# Altium schematic sheet CapTouchKeyboard_v2.0.SchDoc
size 355 x 355 mm
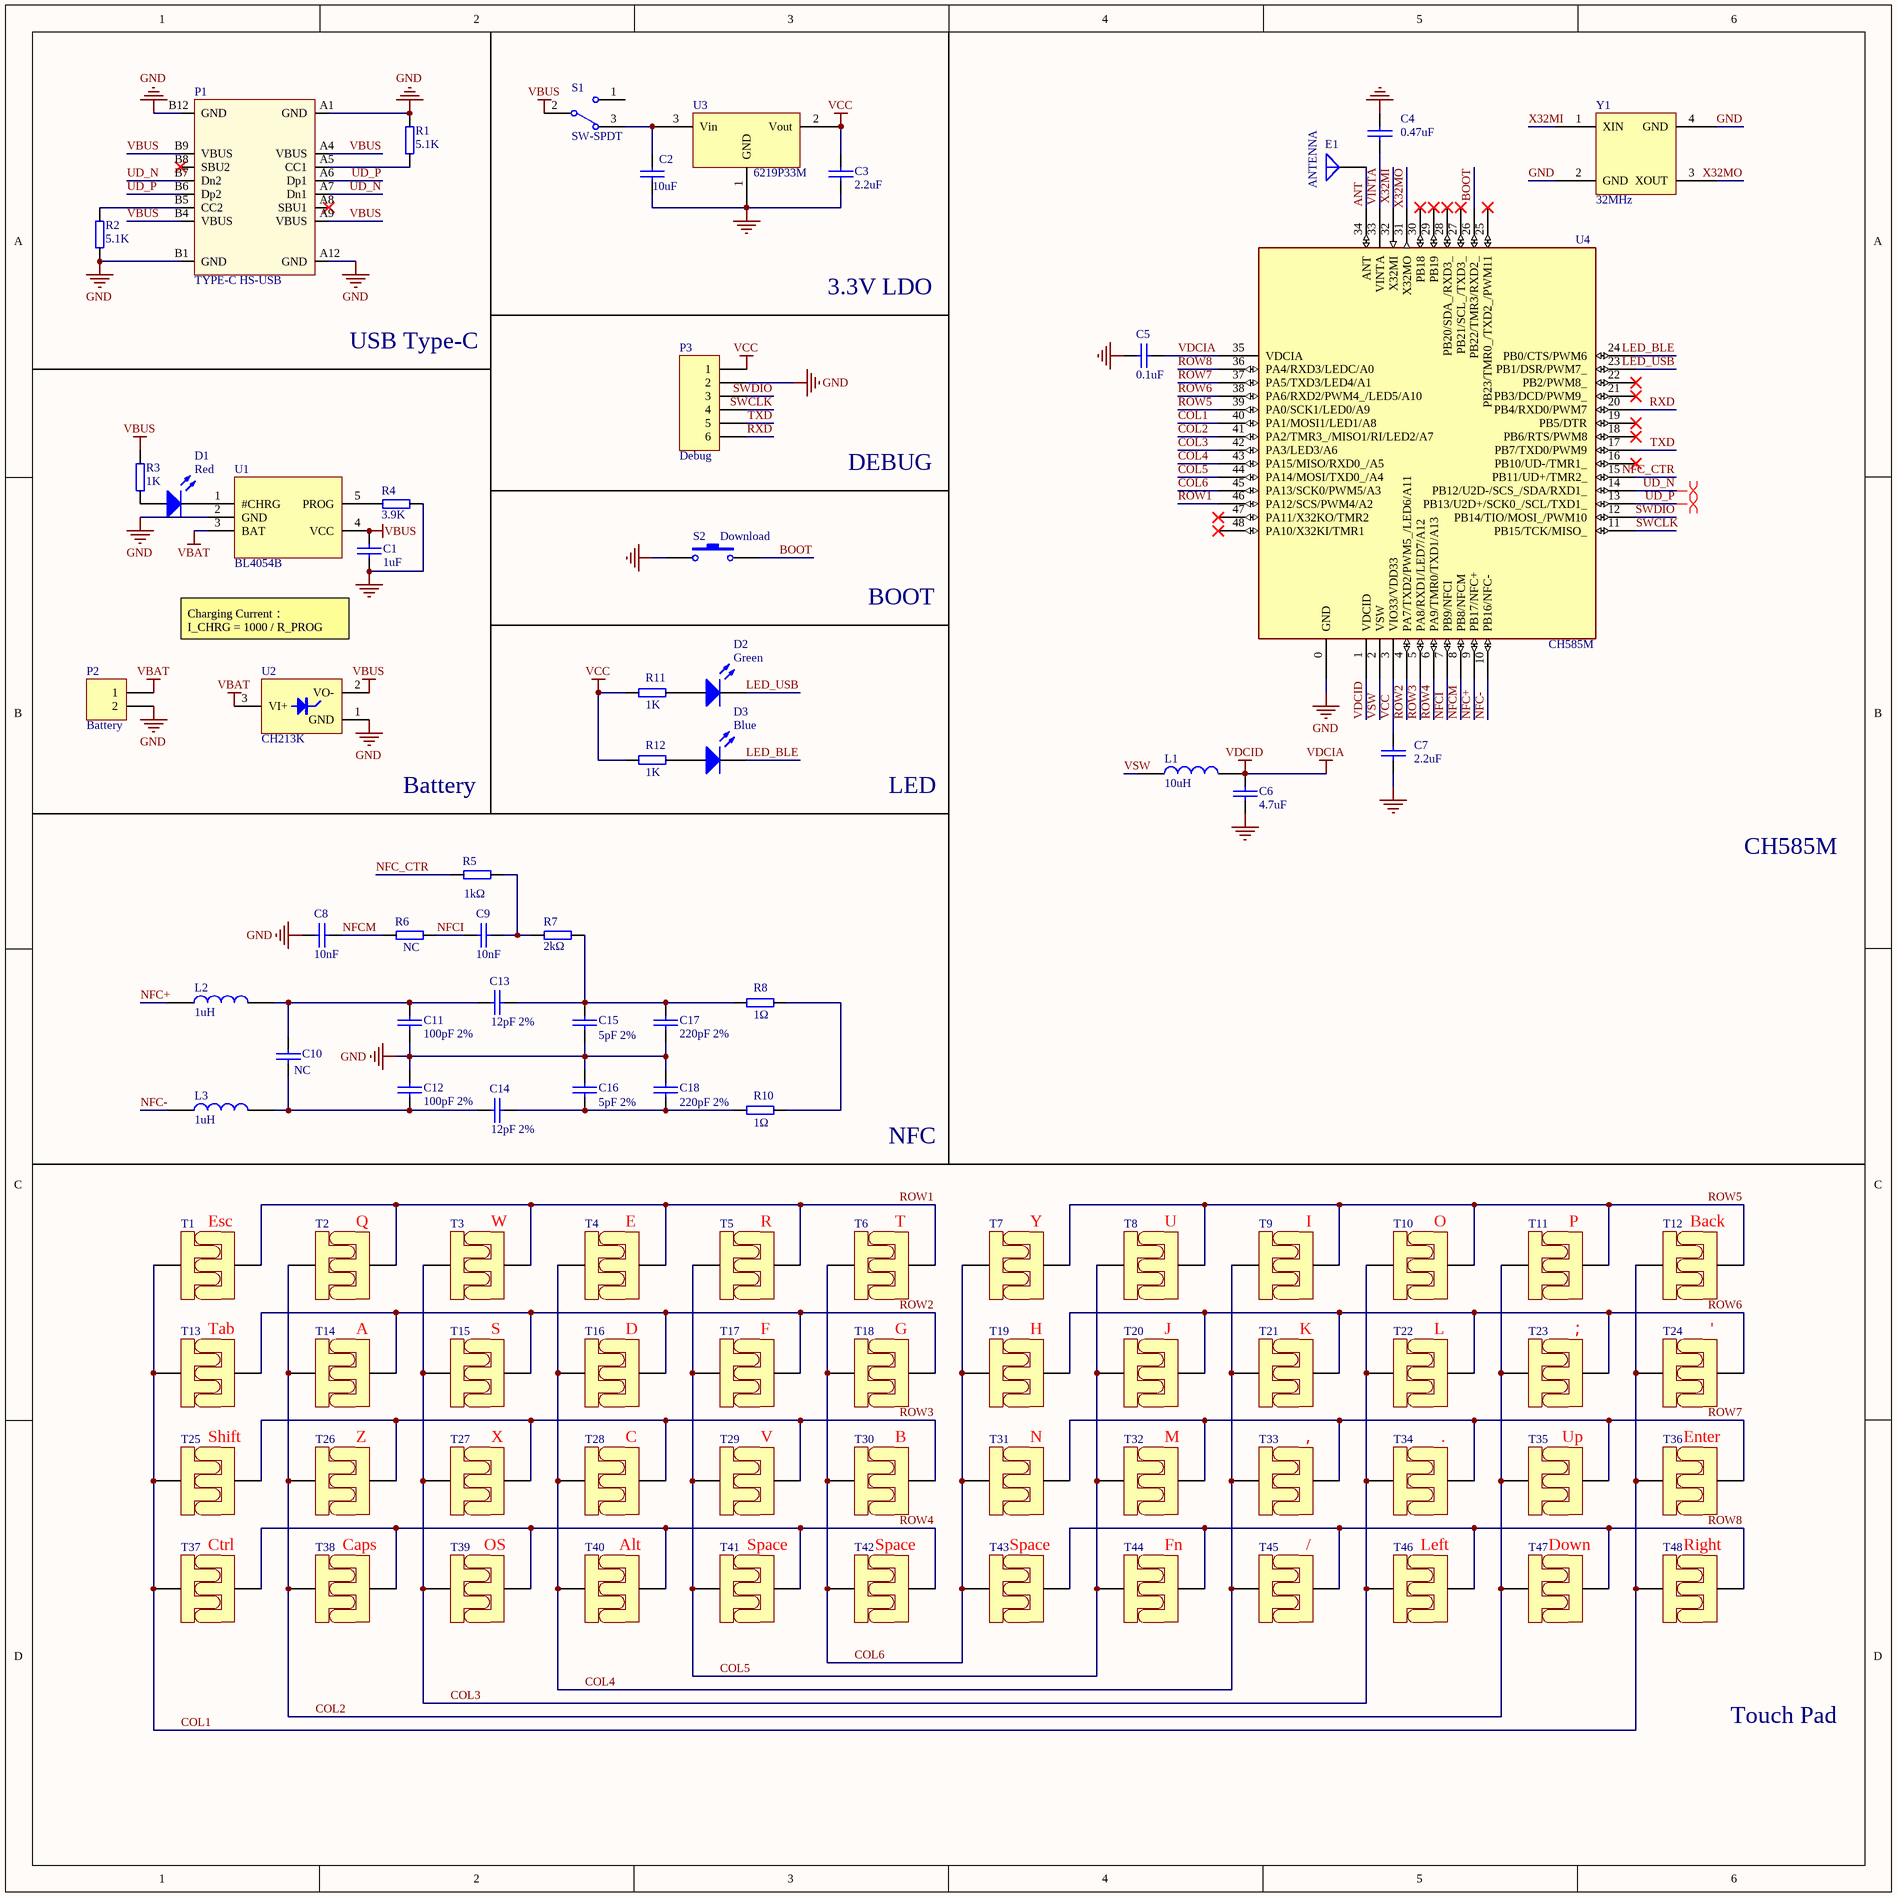
[diagram p0: CapTouchKeyboard_v2.0.SchDoc]

## Parts
C1  1uF  [0402_C]
C2  10uF  [0603_C]
C3  2.2uF  [0402_C]
C4  0.47uF  [0402_C]
C5  0.1uF  [0402_C]
C6  4.7uF  [0402_C]
C7  2.2uF  [0402_C]
C8  10nF  [0402_C]
C9  10nF  [0402_C]
C10  NC  [0402_C]
C11  100pF 2%  [0402_C]
C12  100pF 2%  [0402_C]
C13  12pF 2%  [0402_C]
C14  12pF 2%  [0402_C]
C15  5pF 2%  [0402_C]
C16  5pF 2%  [0402_C]
C17  220pF 2%  [0402_C]
C18  220pF 2%  [0402_C]
D1  Red  [0603+]
D2  Green  [0603+]
D3  Blue  [0603+]
E1  ANTENNA  [ANT-F-1-2.4G-0.8mmFR4-WCH]
L1  10uH  [SMD_2x2mm]
L2  1uH  [0603]
L3  1uH  [0603]
P1  TYPE-C HS-USB  [USB_TYPE_C_DS_2]
P2  Battery  [XH-2P-P1.25mm-WT]
P3  Debug  [HDR1X6H]
R1  5.1K  [0402]
R2  5.1K  [0402]
R3  1K  [0402]
R4  3.9K  [0402]
R5  1kΩ  [0402]
R6  NC  [0402]
R7  2kΩ  [0402]
R8  1Ω  [0402]
R10  1Ω  [0402]
R11  1K  [0402]
R12  1K  [0402]
S1  SW-SPDT  [SW1 - SMD (2)]
S2  Download  [SMD_4.1x2.3x3.5mm-KEY (2)]
T1  TouchPad  [TOUCH_PAD]  (value not drawn)
T2  TouchPad  [TOUCH_PAD]  (value not drawn)
T3  TouchPad  [TOUCH_PAD]  (value not drawn)
T4  TouchPad  [TOUCH_PAD]  (value not drawn)
T5  TouchPad  [TOUCH_PAD]  (value not drawn)
T6  TouchPad  [TOUCH_PAD]  (value not drawn)
T7  TouchPad  [TOUCH_PAD]  (value not drawn)
T8  TouchPad  [TOUCH_PAD]  (value not drawn)
T9  TouchPad  [TOUCH_PAD]  (value not drawn)
T10  TouchPad  [TOUCH_PAD]  (value not drawn)
T11  TouchPad  [TOUCH_PAD]  (value not drawn)
T12  TouchPad  [TOUCH_PAD]  (value not drawn)
T13  TouchPad  [TOUCH_PAD]  (value not drawn)
T14  TouchPad  [TOUCH_PAD]  (value not drawn)
T15  TouchPad  [TOUCH_PAD]  (value not drawn)
T16  TouchPad  [TOUCH_PAD]  (value not drawn)
T17  TouchPad  [TOUCH_PAD]  (value not drawn)
T18  TouchPad  [TOUCH_PAD]  (value not drawn)
T19  TouchPad  [TOUCH_PAD]  (value not drawn)
T20  TouchPad  [TOUCH_PAD]  (value not drawn)
T21  TouchPad  [TOUCH_PAD]  (value not drawn)
T22  TouchPad  [TOUCH_PAD]  (value not drawn)
T23  TouchPad  [TOUCH_PAD]  (value not drawn)
T24  TouchPad  [TOUCH_PAD]  (value not drawn)
T25  TouchPad  [TOUCH_PAD]  (value not drawn)
T26  TouchPad  [TOUCH_PAD]  (value not drawn)
T27  TouchPad  [TOUCH_PAD]  (value not drawn)
T28  TouchPad  [TOUCH_PAD]  (value not drawn)
T29  TouchPad  [TOUCH_PAD]  (value not drawn)
T30  TouchPad  [TOUCH_PAD]  (value not drawn)
T31  TouchPad  [TOUCH_PAD]  (value not drawn)
T32  TouchPad  [TOUCH_PAD]  (value not drawn)
T33  TouchPad  [TOUCH_PAD]  (value not drawn)
T34  TouchPad  [TOUCH_PAD]  (value not drawn)
T35  TouchPad  [TOUCH_PAD]  (value not drawn)
T36  TouchPad  [TOUCH_PAD]  (value not drawn)
T37  TouchPad  [TOUCH_PAD]  (value not drawn)
T38  TouchPad  [TOUCH_PAD]  (value not drawn)
T39  TouchPad  [TOUCH_PAD]  (value not drawn)
T40  TouchPad  [TOUCH_PAD]  (value not drawn)
T41  TouchPad  [TOUCH_PAD]  (value not drawn)
T42  TouchPad  [TOUCH_PAD]  (value not drawn)
T43  TouchPad  [TOUCH_PAD]  (value not drawn)
T44  TouchPad  [TOUCH_PAD]  (value not drawn)
T45  TouchPad  [TOUCH_PAD]  (value not drawn)
T46  TouchPad  [TOUCH_PAD]  (value not drawn)
T47  TouchPad  [TOUCH_PAD]  (value not drawn)
T48  TouchPad  [TOUCH_PAD]  (value not drawn)
U1  BL4054B  [SOT-23-5]
U2  CH213K  [SOT-23-3]
U3  6219P33M  [SOT-23]
U4  CH585M  [QFN48_5X5]
Y1  32MHz  [2016]

## Nets
GND: C1.2 C2.2 C3.2 C4.2 C5.2 C6.1 C7.1 C8.2 C11.1 C12.2 C15.1 C16.2 C17.1 C18.2 P1.A1(GND) P1.A12(GND) P1.B1(GND) P1.B12(GND) P2.2 P3.2 R1.2 R2.1 R4.1 S2.1 U1.2(GND) U2.1(GND) U3.1(GND) U4.0(GND) Y1.2(GND) Y1.4(GND)
VBAT: P2.1 U1.3(BAT) U2.3(VI+)
VBUS: C1.1 P1.A4(VBUS) P1.A9(VBUS) P1.B4(VBUS) P1.B9(VBUS) R3.2 S1.2 U1.4(VCC) U2.2(VO-)
VCC: C3.1 C7.2 P3.1 R11.1 R12.1 U3.2(Vout) U4.3(VIO33/VDD33)
VDCIA: C5.1 C6.2 L1.2 U4.1(VDCID) U4.35(VDCIA)  [also labelled VDCID]
ANT: E1.1(A) U4.34(ANT)
BOOT: S2.2 U4.26(PB22/TMR3/RXD2_)
COL1: T1.1 T12.1 T13.1 T24.1 T25.1 T36.1 T37.1 T48.1 U4.40(PA1/MOSI1/LED1/A8)
COL2: T2.1 T11.1 T14.1 T23.1 T26.1 T35.1 T38.1 T47.1 U4.41(PA2/TMR3_/MISO1/RI/LED2/A7)
COL3: T3.1 T10.1 T15.1 T22.1 T27.1 T34.1 T39.1 T46.1 U4.42(PA3/LED3/A6)
COL4: T4.1 T9.1 T16.1 T21.1 T28.1 T33.1 T40.1 T45.1 U4.43(PA15/MISO/RXD0_/A5)
COL5: T5.1 T8.1 T17.1 T20.1 T29.1 T32.1 T41.1 T44.1 U4.44(PA14/MOSI/TXD0_/A4)
COL6: T6.1 T7.1 T18.1 T19.1 T30.1 T31.1 T42.1 T43.1 U4.45(PA13/SCK0/PWM5/A3)
LED_BLE: D3.2(K) U4.24(PB0/CTS/PWM6)
LED_USB: D2.2(K) U4.23(PB1/DSR/PWM7_)
NFC+: L2.1 U4.9(PB17/NFC+)
NFC-: L3.1 U4.10(PB16/NFC-)
NFC_CTR: R5.2 U4.15(PB11/UD+/TMR2_)
NFCI: C9.1 R6.1 U4.7(PB9/NFCI)
NFCM: C8.1 R6.2 U4.8(PB8/NFCM)
ROW1: T1.2 T2.2 T3.2 T4.2 T5.2 T6.2 U4.46(PA12/SCS/PWM4/A2)
ROW2: T13.2 T14.2 T15.2 T16.2 T17.2 T18.2 U4.4(PA7/TXD2/PWM5_/LED6/A11)
ROW3: T25.2 T26.2 T27.2 T28.2 T29.2 T30.2 U4.5(PA8/RXD1/LED7/A12)
ROW4: T37.2 T38.2 T39.2 T40.2 T41.2 T42.2 U4.6(PA9/TMR0/TXD1/A13)
ROW5: T7.2 T8.2 T9.2 T10.2 T11.2 T12.2 U4.39(PA0/SCK1/LED0/A9)
ROW6: T19.2 T20.2 T21.2 T22.2 T23.2 T24.2 U4.38(PA6/RXD2/PWM4_/LED5/A10)
ROW7: T31.2 T32.2 T33.2 T34.2 T35.2 T36.2 U4.37(PA5/TXD3/LED4/A1)
ROW8: T43.2 T44.2 T45.2 T46.2 T47.2 T48.2 U4.36(PA4/RXD3/LEDC/A0)
RXD: P3.6 U4.20(PB4/RXD0/PWM7)
SWCLK: P3.4 U4.11(PB15/TCK/MISO_)
SWDIO: P3.3 U4.12(PB14/TIO/MOSI_/PWM10)
TXD: P3.5 U4.17(PB7/TXD0/PWM9)
UD_N: P1.A7(Dn1) P1.B7(Dn2) U4.14(PB12/U2D-/SCS_/SDA/RXD1_)
UD_P: P1.A6(Dp1) P1.B6(Dp2) U4.13(PB13/U2D+/SCK0_/SCL/TXD1_)
VINTA: C4.1 U4.33(VINTA)
VSW: L1.1 U4.2(VSW)
X32MI: U4.32(X32MI) Y1.1(XIN)
X32MO: U4.31(X32MO) Y1.3(XOUT)
NetC2_1: C2.1 S1.3 U3.3(Vin)
NetC9_2: C9.2 R5.1 R7.2
NetC10_1: C10.1 C12.1 C14.1 L3.2
NetC10_2: C10.2 C11.2 C13.1 L2.2
NetC13_2: C13.2 C15.2 C17.2 R7.1 R8.1
NetC14_2: C14.2 C16.1 C18.1 R10.1
NetD1_1: D1.1(A) R3.1
NetD1_2: D1.2(K) U1.1(#CHRG)
NetD2_1: D2.1(A) R11.2
NetD3_1: D3.1(A) R12.2
NetP1_A5: P1.A5(CC1) R1.1
NetP1_B5: P1.B5(CC2) R2.2
NetR4_2: R4.2 U1.5(PROG)
NetR8_2: R8.2 R10.2

Not connected (* = marked no-connect by the designer): P1 A8(SBU1)* B8(SBU2)*; S1 1; U4 16(PB10/UD-/TMR1_)* 18(PB6/RTS/PWM8)* 19(PB5/DTR)* 21(PB3/DCD/PWM9_)* 22(PB2/PWM8_)* 25(PB23/TMR0_/TXD2_/PWM11)* 27(PB21/SCL_/TXD3_)* 28(PB20/SDA_/RXD3_)* 29(PB19)* 30(PB18)* 47(PA11/X32KO/TMR2)* 48(PA10/X32KI/TMR1)*

## Layout directives
differential pair: UD_N, UD_P

## Notes on the sheet
- 3.3V LDO
- USB Type-C
- DEBUG
- Charging Current：
  I_CHRG = 1000 / R_PROG
- BOOT
- Battery
- LED
- CH585M
- NFC
- (near T1) Esc
- (near T2) Q
- (near T3) W
- (near T4) E
- (near T5) R
- (near T6) T
- (near T7) Y
- (near T8) U
- (near T9) I
- (near T10) O
- (near T11) P
- (near T12) Back
- (near T13) Tab
- (near T14) A
- (near T15) S
- (near T16) D
- (near T17) F
- (near T18) G
- (near T19) H
- (near T20) J
- (near T21) K
- (near T22) L
- (near T23) ；
- (near T24) '
- (near T25) Shift
- (near T26) Z
- (near T27) X
- (near T28) C
- (near T29) V
- (near T30) B
- (near T31) N
- (near T32) M
- (near T33) ，
- (near T34) .
- (near T35) Up
- (near T36) Enter
- (near T37) Ctrl
- (near T38) Caps
- (near T39) OS
- (near T40) Alt
- (near T41) Space
- (near T42) Space
- (near T43) Space
- (near T44) Fn
- (near T45) /
- (near T46) Left
- (near T47) Down
- (near T48) Right
- Touch Pad

## Library data of the parts
C1-C18 = CAP: Capacitor
D1-D3 = LED0: Typical INFRARED GaAs LED; Published: 8-Jun-2000; LatestRevisionDate: 08-Jul-2005; LatestRevisionNote: Mech Layer 1 removed.; PackageReference: LED-0; Publisher: Altium Limited
E1 = ANTENNA: Generic Antenna
L1-L3 = INDUCTOR
P1 = TYPE-C-Receptacle-2.0: Type-C USB2.0 母座
P2 = HEADER 2: Header, 2-Pin
P3 = HEADER 6: Header, 6-Pin
R1-R8 R10-R12 = RES
S1 = SW-SPDT: SPDT Subminiature Toggle Switch, Right Angle Mounting, Vertical Actuation; Published: 24-Mar-1999; LatestRevisionDate: 17-Dec-2003; LatestRevisionNote: Schematic revised, PCB Footprint replaced.; DatasheetVersion: 05-Dec-2000; PackageReference: TL36WW15050; Publisher: Altium Limited; PackageDescription: Switch; 4 Leads; ComponentLink1Description: Manufacturer Link; ComponentLink1URL: http://www.apem.com
S2 = SW-PB: Switch; Published: 24-Mar-1999; LatestRevisionDate: 17-Jul-2002; LatestRevisionNote: Re-released for DXP Platform.; PackageReference: SPST-2; Publisher: Altium Limited; PackageDescription: Switch; 2 Leads
U1 = BL4054B: 具有热调节功能的800mA独立线性锂离子电池充电器
U2 = CH213K: Ideal Diode 5V*1A
U4 = CH585M: RISC-V MCU with BLE/HSUSB/USB/NFC/ADC/PWM/2*SPI/I2C/4*UART/LCD
Y1 = 晶体